# EAGLE design disp board (EAGLE 7.3.0)
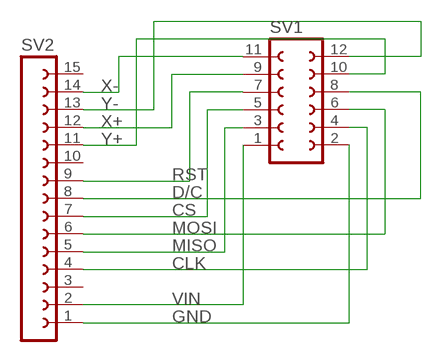
[diagram p0: schematic, sheet 1]

## Parts
SV1  FE06-2  [FE06-2]
SV2  FE15-1  [FE15]

## Nets
CLK: SV1.4 SV2.4
CS: SV1.5 SV2.7
D/C: SV1.8 SV2.8
GND: SV1.2 SV2.1
MISO: SV1.3 SV2.5
MOSI: SV1.6 SV2.6
RST: SV1.7 SV2.9
VIN: SV1.1 SV2.2
X+: SV1.9 SV2.12
X-: SV1.11 SV2.14
Y+: SV1.10 SV2.11
Y-: SV1.12 SV2.13
Unconnected: SV2.3 SV2.10 SV2.15

## Library data of the parts
SV1 = con-lsta:FE06-2: FEMALE HEADER; OC_FARNELL: unknown; OC_NEWARK: unknown
SV2 = con-lsta:FE15-1: FEMALE HEADER; OC_FARNELL: unknown; OC_NEWARK: unknown

## Board
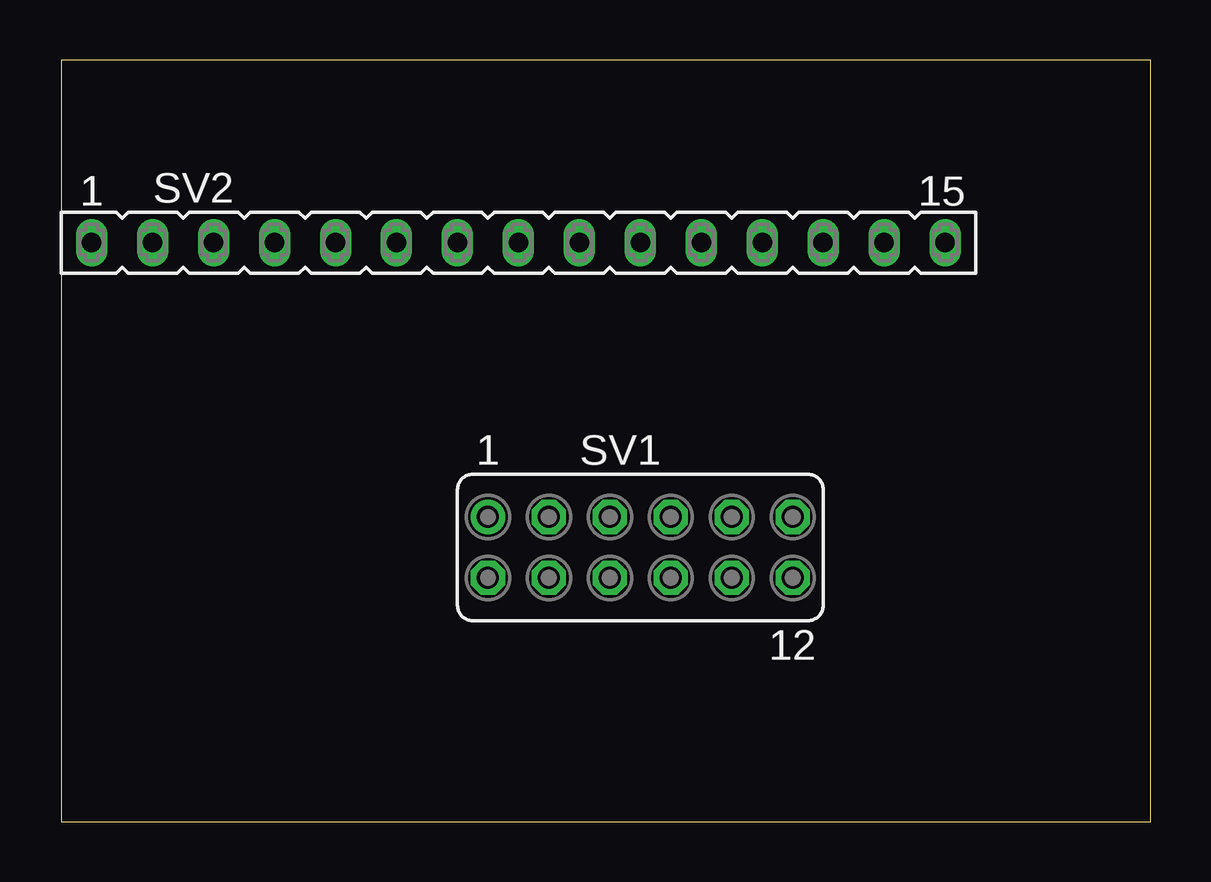
[diagram p1: board, top side]
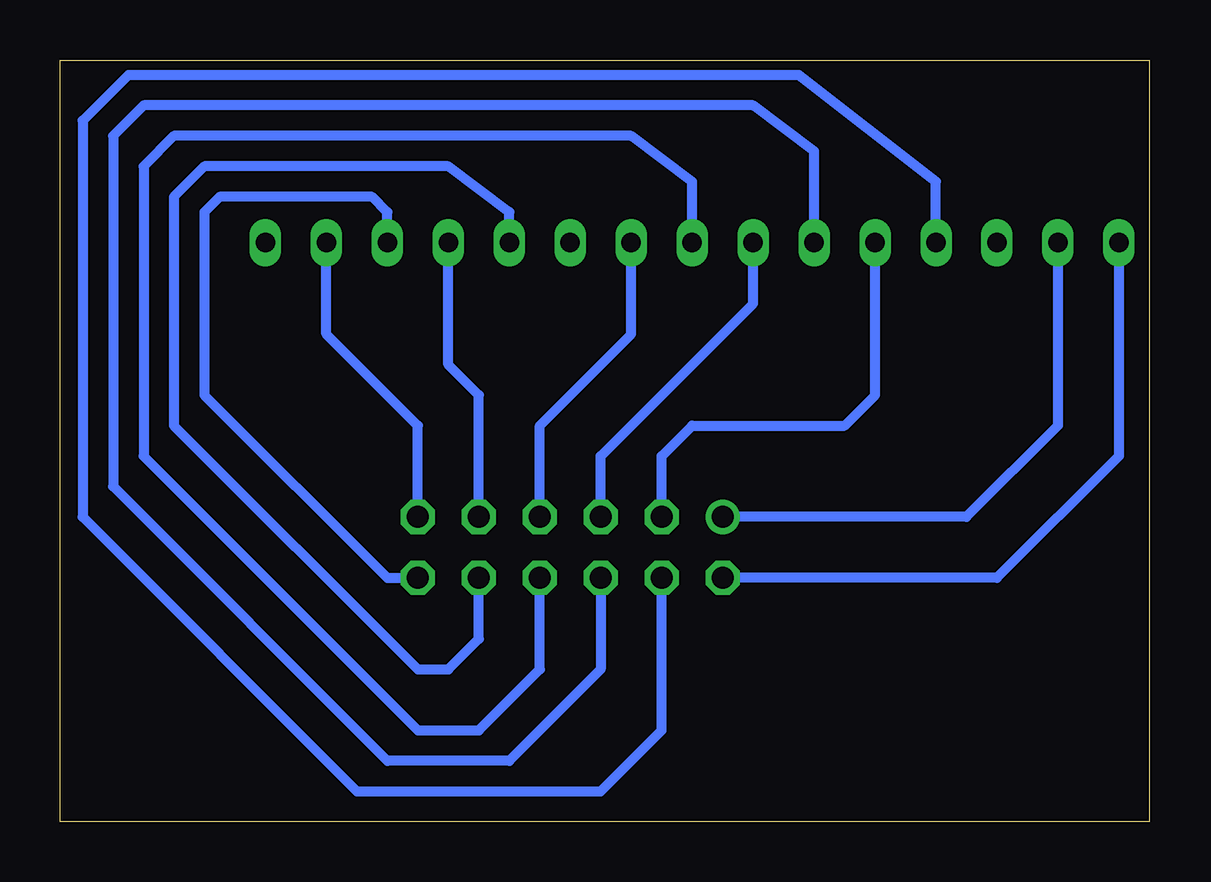
[diagram p2: board, bottom side, seen from below]

Size 45.39 x 31.74 mm. Coordinates in mm from the lower left corner, seen from the top.
Outline: 0,0 45.39,0 45.39,31.74 0,31.74 0,0
Copper layers (1*16): Top 0.035mm / dielectric 1.5mm / Bottom 0.035mm
Design rules "Othermill-DRC-1-32": minimum track width 8mil, minimum drill 0.8mm, track to track 0.794003125mm, track to pad 0.794003125mm, pad to pad 0.794003125mm, via to via 0.794003125mm, smd to smd 0mil, copper to edge 0mil, drill to drill 1mil, minimum pad ring 10mil, minimum via ring 10mil, stop-mask expansion 1mil, vias tented up to drill 30mil, thermal gap 10mil

### Footprints (pad centres in the part's own frame; a part is rotated, then mirrored left to right if it is on the bottom)
FE06-2 = drill 0.914: 1 -6.35,1.27 | drill 0.914 octagon: 2 -6.35,-1.27; 3 -3.81,1.27; 4 -3.81,-1.27; 5 -1.27,1.27; 6 -1.27,-1.27; 7 1.27,1.27; 8 1.27,-1.27; 9 3.81,1.27; 10 3.81,-1.27; 11 6.35,1.27; 12 6.35,-1.27
FE15 = drill 0.813 long: 1 -17.78,0; 2 -15.24,0; 3 -12.7,0; 4 -10.16,0; 5 -7.62,0; 6 -5.08,0; 7 -2.54,0; 8 0,0; 9 2.54,0; 10 5.08,0; 11 7.62,0; 12 10.16,0; 13 12.7,0; 14 15.24,0; 15 17.78,0

### Placement (x,y rotation side)
SV1  24.13,11.43 0 top
SV2  19.05,24.13 0 top

### Tracks (layer width: path | path; a pad name or v marks a point on that pad's centre or on a via)
CLK
  Bottom 0.406: SV2.4 8.89,26.67 14.6,31.12 42.55,31.12 44.45,29.21 44.45,12.7 33.02,1.27 22.86,1.27 20.32,3.81 SV1.4
CS
  Bottom 0.406: SV1.5 22.86,15.24 16.51,21.59 SV2.7
D/C
  Bottom 0.406: SV2.8 19.05,26.67 21.59,28.57 40.64,28.57 41.91,27.3 41.91,15.24 30.48,3.81 27.94,3.81 25.4,6.35 SV1.8
GND
  Bottom 0.406: SV2.1 1.27,15.24 6.35,10.16 SV1.2
MISO
  Bottom 0.406: SV1.3 20.32,15.24 19.05,16.51 12.7,16.51 11.43,17.78 SV2.5
MOSI
  Bottom 0.406: SV2.6 13.97,27.94 16.51,29.85 41.91,29.85 43.18,28.57 43.18,13.97 31.75,2.54 26.67,2.54 22.86,6.35 SV1.6
RST
  Bottom 0.406: SV1.7 25.4,16.51 21.59,20.32 SV2.9
VIN
  Bottom 0.406: SV2.2 3.81,16.51 7.62,12.7 SV1.1
X+
  Bottom 0.406: SV1.9 27.94,17.78 29.21,19.05 SV2.12
X-
  Bottom 0.406: SV1.11 30.48,16.51 34.29,20.32 SV2.14
Y+
  Bottom 0.406: SV2.11 26.67,25.4 29.21,27.3 39.37,27.3 40.64,26.04 40.64,16.51 30.48,6.35 29.21,6.35 27.94,7.62 SV1.10
Y-
  Bottom 0.406: SV2.13 31.75,25.4 32.38,26.04 38.73,26.04 39.37,25.4 39.37,17.78 31.75,10.16 SV1.12